# EAGLE design GasSensorCentral_v3.2 (EAGLE 7.4.0)
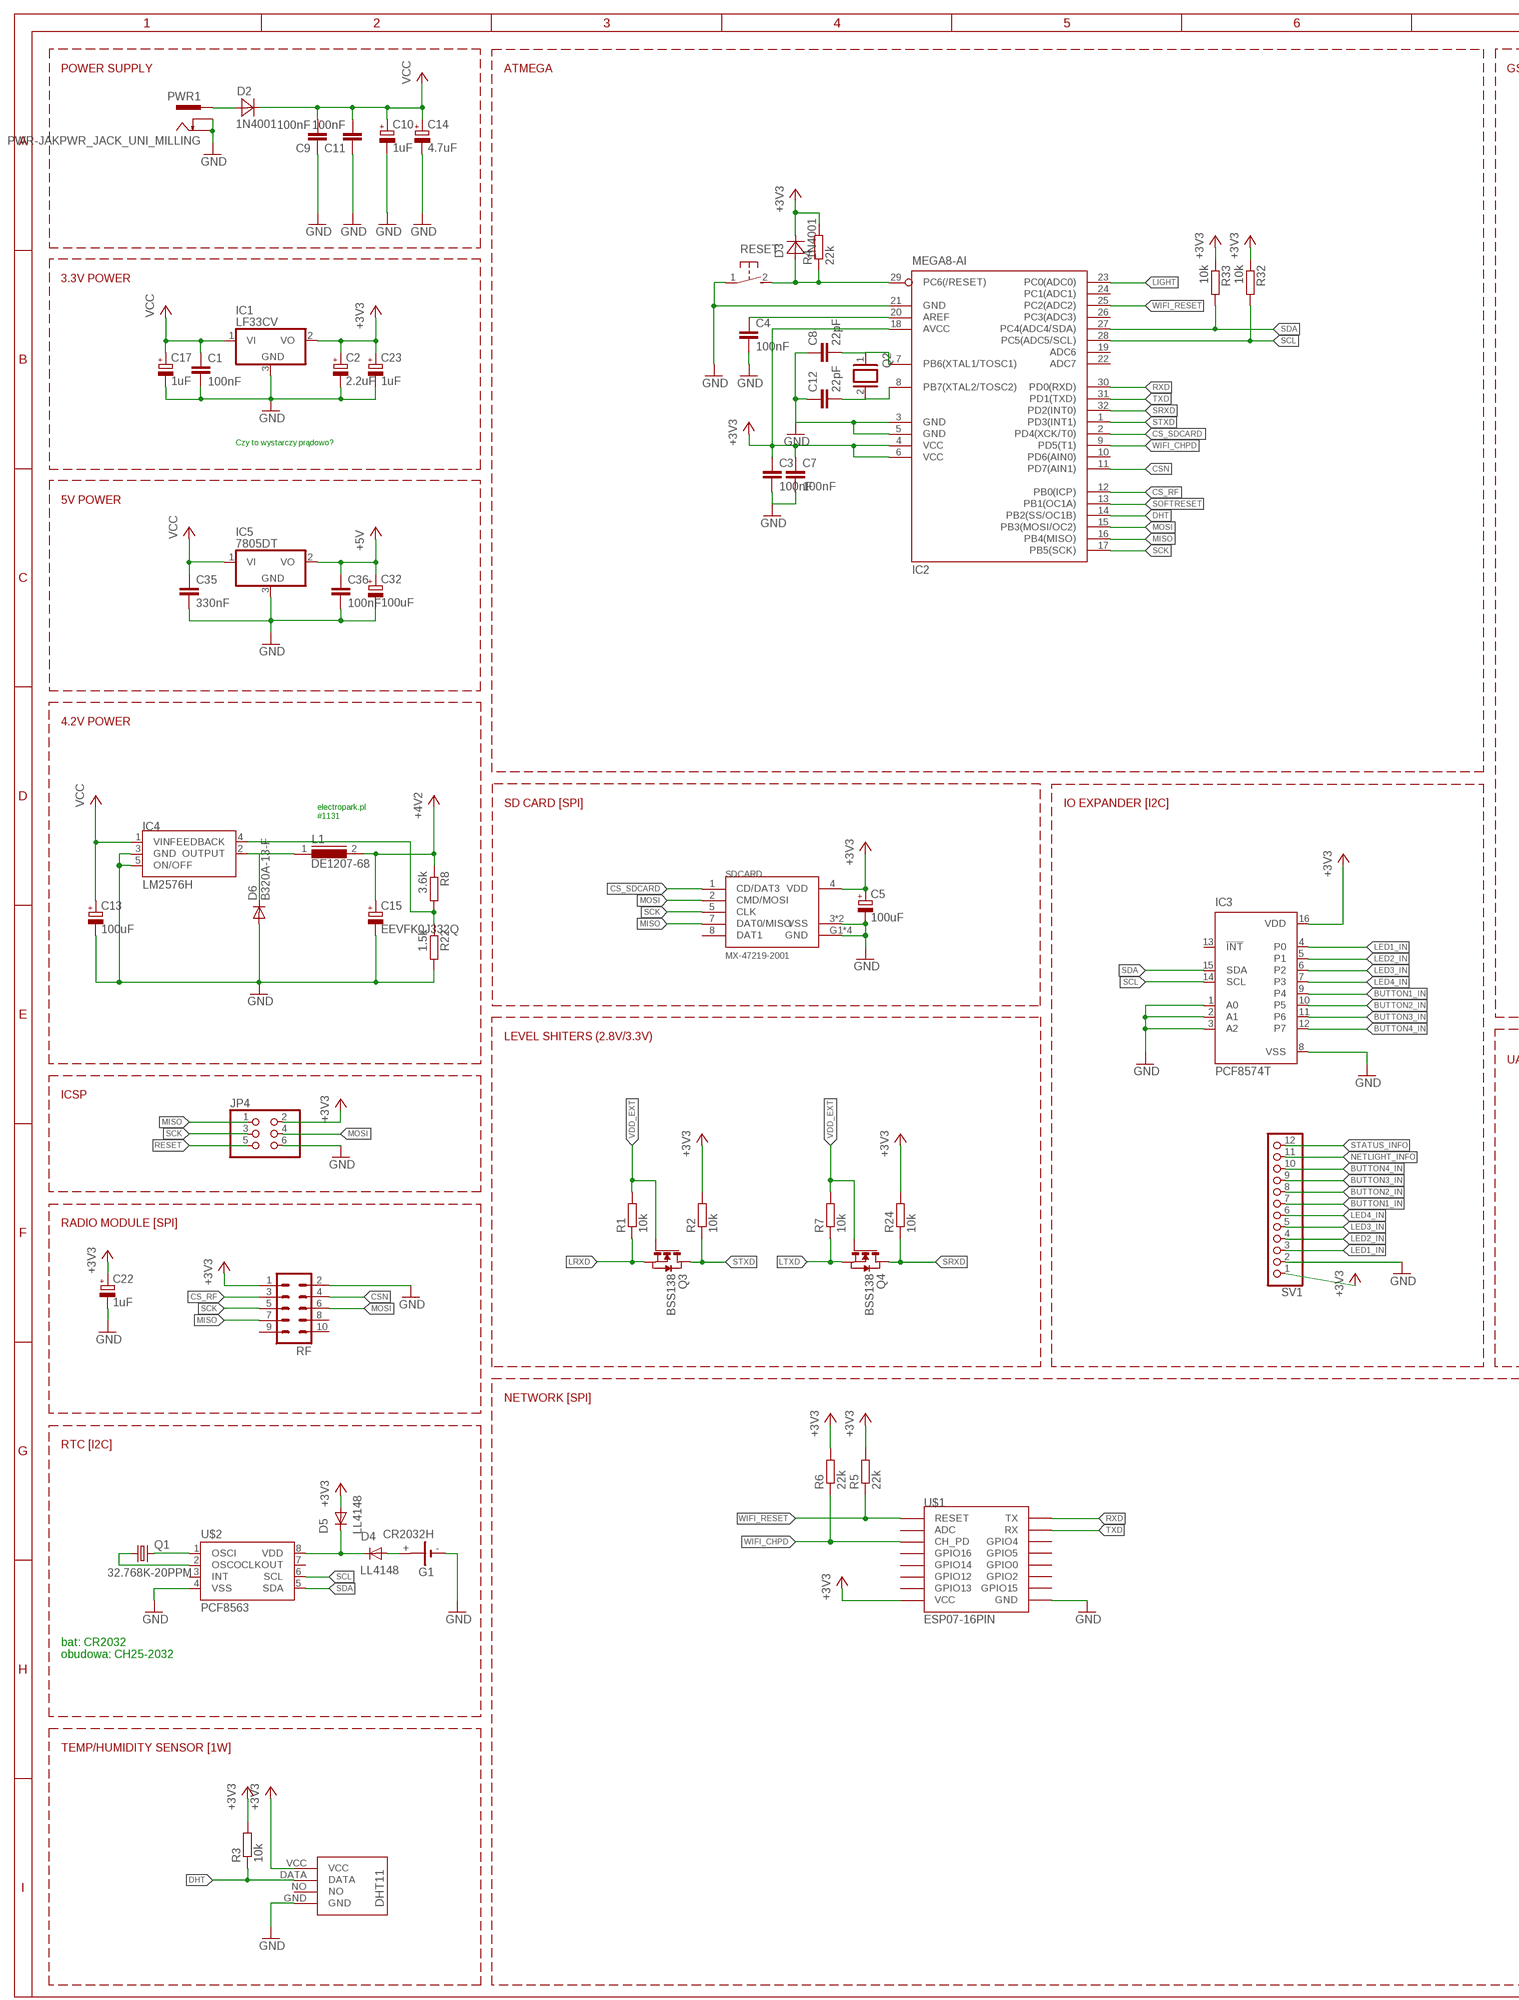
[diagram p0: schematic, sheet 1, part 1 of 2]
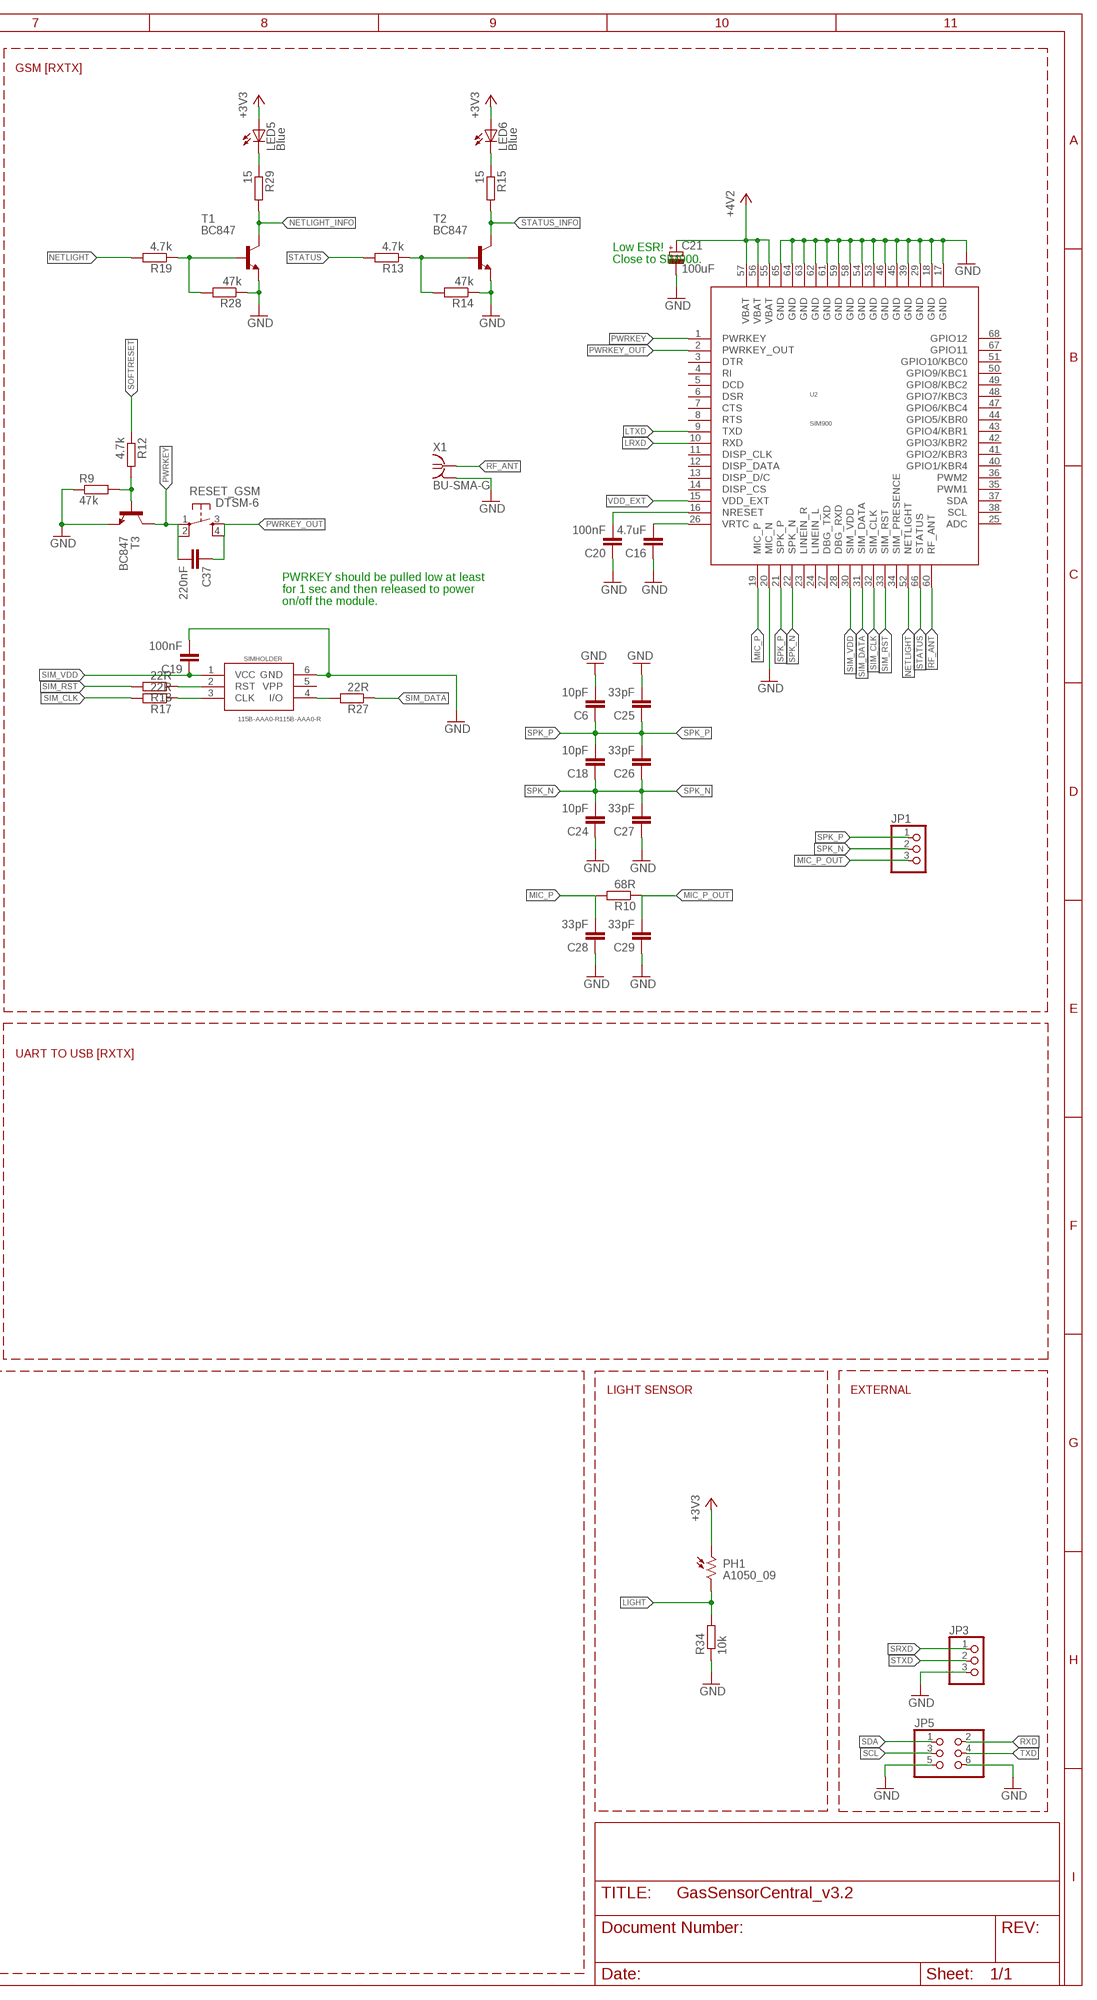
[diagram p1: schematic, sheet 1, part 2 of 2]

## Parts
C1  100nF  C-EUC0805  [C0805]
C2  2.2uF  CPOL-EUB  [PANASONIC_B]
C3  100nF  C-EUC0805  [C0805]
C4  100nF  C-EUC0805  [C0805]
C5  100uF  CPOL-EUB  [PANASONIC_B]
C6  10pF  C-EUC0805  [C0805]
C7  100nF  C-EUC0805  [C0805]
C8  22pF  C-EUC0805  [C0805]
C9  100nF  C-EUC0805  [C0805]
C10  1uF  CPOL-EUB  [PANASONIC_B]
C11  100nF  C-EUC0805  [C0805]
C12  22pF  C-EUC0805  [C0805]
C13  100uF  CPOL-EUB  [PANASONIC_B]
C14  4.7uF  CPOL-EUB  [PANASONIC_B]
C15  EEVFK0J332Q  CPOL-EU  [153CLV-1212]
C16  4.7uF  C-EUC0805  [C0805]
C17  1uF  CPOL-EUB  [PANASONIC_B]
C18  10pF  C-EUC0805  [C0805]
C19  100nF  C-EUC0805  [C0805]
C20  100nF  C-EUC0805  [C0805]
C21  100uF  CPOL-EUB  [PANASONIC_B]
C22  1uF  CPOL-EUB  [PANASONIC_B]
C23  1uF  CPOL-EUB  [PANASONIC_B]
C24  10pF  C-EUC0805  [C0805]
C25  33pF  C-EUC0805  [C0805]
C26  33pF  C-EUC0805  [C0805]
C27  33pF  C-EUC0805  [C0805]
C28  33pF  C-EUC0805  [C0805]
C29  33pF  C-EUC0805  [C0805]
C32  100uF  CPOL-EUB  [PANASONIC_B]
C35  330nF  C-EUC0805  [C0805]
C36  100nF  C-EUC0805  [C0805]
C37  220nF  C-EUC0805  [C0805]
D2  1N4001  MBRA340T3  [SMA]
D3  1N4001  MBRA340T3  [SMA]
D4  LL4148  DIODE-SOD80C  [SOD80C]
D5  LL4148  DIODE-SOD80C  [SOD80C]
D6  B320A-13-F  DIODE-DO214AC  [DO214AC]
G1  CR2032H  [CR2032H]
IC1  LF33CV  78DT  [TO252]
IC2  MEGA8-AI  [TQFP32-08]
IC3  PCF8574T  [SO16W]
IC4  LM2576H  [TO220-52]
IC5  7805DT  [TO252]
JP1  PINHD-1X3/90  [1X03/90]
JP3  PINHD-1X3  [1X03]
JP4  PINHD-2X3  [2X03]
JP5  PINHD-2X3  [2X03]
L1  DE1207-68  DE1207  [DE1207]
LED5  Blue  LEDSML0805  [SML0805]
LED6  Blue  LEDSML0805  [SML0805]
PH1  A1050_09  [T0-46-A10XX]
PWR1  PWR-JAKPWR_JACK_UNI_MILLING  [PWR_JACK_UNI_MILLING]
Q1  32.768K-20PPM  CRYSTALTC26V  [TC26V]
Q2  XTAL/S  [QS]
Q3  BSS138  NMOSSOT23  [SOT-23]
Q4  BSS138  NMOSSOT23  [SOT-23]
R1  10k  R-EU_R0805  [R0805]
R2  10k  R-EU_R0805  [R0805]
R3  10k  R-EU_R0805  [R0805]
R4  22k  R-EU_R0805  [R0805]
R5  22k  R-EU_R0805  [R0805]
R6  22k  R-EU_R0805  [R0805]
R7  10k  R-EU_R0805  [R0805]
R8  3.6k  R-EU_R0805  [R0805]
R9  47k  R-EU_R0805  [R0805]
R10  68R  R-EU_R0805  [R0805]
R12  4.7k  R-EU_R0805  [R0805]
R13  4.7k  R-EU_R0805  [R0805]
R14  47k  R-EU_R0805  [R0805]
R15  15  R-EU_R0805  [R0805]
R17  22R  R-EU_R0805  [R0805]
R18  22R  R-EU_R0805  [R0805]
R19  4.7k  R-EU_R0805  [R0805]
R22  1.5k  R-EU_R0805  [R0805]
R24  10k  R-EU_R0805  [R0805]
R27  22R  R-EU_R0805  [R0805]
R28  47k  R-EU_R0805  [R0805]
R29  15  R-EU_R0805  [R0805]
R32  10k  R-EU_R0805  [R0805]
R33  10k  R-EU_R0805  [R0805]
R34  10k  R-EU_R0805  [R0805]
RESET  31-XX  [B3F-31XX]
RESET_GSM  DTSM-6  [DTSM-6]
RF  ML10  [ML10]
SDCARD  MX-47219-2001  [MX-47219-2001]
SIMHOLDER  115B-AAA0-R115B-AAA0-R  [115B-AAA0-R]
SV1  PINHD-1X12  [1X12]
T1  BC847  [SOT23]
T2  BC847  [SOT23]
T3  BC847  [SOT23]
U2  SIM900  [SIM900]
U$1  ESP07-16PIN  [ESP07-16PIN]
U$2  PCF8563  [SO08]
U$3  DHT11-PION.  [DHT11-PION.]
X1  BU-SMA-G  [BU-SMA-G]

## Nets
+3V3: C2.+ C3.1 C5.+ C7.1 C22.+ C23.+ D3.C D5.A IC1.2(VO) IC2.4(VCC) IC2.6(VCC) IC2.18(AVCC) IC3.16(VDD) JP4.2 LED5.A LED6.A PH1.1 R2.2 R3.2 R4.2 R5.2 R6.2 R24.2 R32.1 R33.1 RF.1 SDCARD.4(VDD) SV1.1 U$1.VCC U$3.VCC
+4V2: C15.+ C21.+ L1.2 R8.1 U2.55(VBAT) U2.56(VBAT) U2.57(VBAT)
+5V: C32.+ C36.1 IC5.2(VO)
BUTTON1_IN: IC3.9(P4) SV1.7
BUTTON2_IN: IC3.10(P5) SV1.8
BUTTON3_IN: IC3.11(P6) SV1.9
BUTTON4_IN: IC3.12(P7) SV1.10
CS_RF: IC2.12(PB0(ICP)) RF.3
CS_SDCARD: IC2.2(PD4(XCK/T0)) SDCARD.1(CD/DAT3)
CSN: IC2.11(PD7(AIN1)) RF.4
DHT: IC2.14(PB2(SS/OC1B)) R3.1 U$3.DATA
GND: C1.2 C2.- C3.2 C4.2 C5.- C6.2 C7.2 C8.1 C9.1 C10.- C11.1 C12.1 C13.- C14.- C15.- C16.1 C17.- C19.2 C20.1 C21.- C22.- C23.- C24.1 C25.2 C27.1 C28.1 C29.1 C32.- C35.2 C36.2 G1.- IC1.3(GND) IC2.3(GND) IC2.5(GND) IC2.21(GND) IC3.1(A0) IC3.2(A1) IC3.3(A2) IC3.8(VSS) IC4.3(GND) IC4.5(ON/OFF) IC5.3(GND) JP3.3 JP4.6 JP5.5 JP5.6 PWR1.- PWR1.-1(-) PWR1.-2(-) PWR1.-3(-) PWR1.-4(-) PWR1.-5(-) PWR1.-6(-) PWR1.-- PWR1.--1(--) PWR1.--2(--) PWR1.--3(--) PWR1.--4(--) PWR1.--5(--) PWR1.--6(--) R9.1 R14.1 R22.2 R28.1 R34.1 RESET.1(P) RF.2 SDCARD.3(VSS) SDCARD.6(VSS) SDCARD.G1(GND) SDCARD.G2(GND) SDCARD.G3(GND) SDCARD.G4(GND) SIMHOLDER.6(GND) SV1.2 T1.2(E) T2.2(E) T3.2(E) U2.17(GND) U2.18(GND) U2.20(MIC_N) U2.29(GND) U2.39(GND) U2.45(GND) U2.46(GND) U2.53(GND) U2.54(GND) U2.58(GND) U2.59(GND) U2.61(GND) U2.62(GND) U2.63(GND) U2.64(GND) U2.65(GND) U$1.GND U$2.4(VSS) U$3.GND X1.2 X1.3 X1.4 X1.5
LED1_IN: IC3.4(P0) SV1.3
LED2_IN: IC3.5(P1) SV1.4
LED3_IN: IC3.6(P2) SV1.5
LED4_IN: IC3.7(P3) SV1.6
LIGHT: IC2.23(PC0(ADC0)) PH1.2 R34.2
LRXD: Q3.2(S) R1.1 U2.10(RXD)
LTXD: Q4.2(S) R7.1 U2.9(TXD)
MIC_P: C28.2 R10.2 U2.19(MIC_P)
MIC_P_OUT: C29.2 JP1.3 R10.1
MISO: IC2.16(PB4(MISO)) JP4.1 RF.7 SDCARD.7(DAT0/MISO)
MOSI: IC2.15(PB3(MOSI/OC2)) JP4.4 RF.6 SDCARD.2(CMD/MOSI)
N$1: C4.1 IC2.20(AREF)
N$2: Q1.1 U$2.2(OSCO)
N$3: IC4.4(FEEDBACK) R8.2 R22.1
N$4: D2.A PWR1.+ PWR1.+1(+) PWR1.+2(+) PWR1.+3(+) PWR1.+4(+) PWR1.+5(+) PWR1.+6(+)
N$5: D4.C D5.C U$2.8(VDD)
N$6: R27.2 SIMHOLDER.4(I/O)
N$7: LED5.C R29.1
N$8: Q1.2 U$2.1(OSCI)
N$9: R13.1 R14.2 T2.1(B)
N$10: D6.A
N$11: LED6.C R15.1
N$12: D6.C IC4.2(OUTPUT) L1.1
N$13: C20.2 U2.16(NRESET)
N$14: R9.2 R12.2 T3.1(B)
N$15: R19.1 R28.2 T1.1(B)
N$16: D4.A G1.+
N$17: C16.2 U2.26(VRTC)
N$24: R18.1 SIMHOLDER.2(RST)
N$25: R17.1 SIMHOLDER.3(CLK)
N$29: C8.2 IC2.7(PB6(XTAL1/TOSC1)) Q2.1
N$35: C12.2 IC2.8(PB7(XTAL2/TOSC2)) Q2.2
NETLIGHT: R19.2 U2.52(NETLIGHT)
NETLIGHT_INFO: R29.2 SV1.11 T1.3(C)
PWRKEY: C37.2 RESET_GSM.1 RESET_GSM.2 T3.3(C) U2.1(PWRKEY)
PWRKEY_OUT: C37.1 RESET_GSM.3 RESET_GSM.4 U2.2(PWRKEY_OUT)
RESET: D3.A IC2.29(PC6(/RESET)) JP4.5 R4.1 RESET.2(S)
RF_ANT: U2.60(RF_ANT) X1.1
RXD: IC2.30(PD0(RXD)) JP5.2 U$1.TX
SCK: IC2.17(PB5(SCK)) JP4.3 RF.5 SDCARD.5(CLK)
SCL: IC2.28(PC5(ADC5/SCL)) IC3.14(SCL) JP5.3 R32.2 U$2.6(SCL)
SDA: IC2.27(PC4(ADC4/SDA)) IC3.15(SDA) JP5.1 R33.2 U$2.5(SDA)
SIM_CLK: R17.2 U2.32(SIM_CLK)
SIM_DATA: R27.1 U2.31(SIM_DATA)
SIM_RST: R18.2 U2.33(SIM_RST)
SIM_VDD: C19.1 SIMHOLDER.1(VCC) U2.30(SIM_VDD)
SOFTRESET: IC2.13(PB1(OC1A)) R12.1
SPK_N: C18.1 C24.2 C26.1 C27.2 JP1.2 U2.22(SPK_N)
SPK_P: C6.1 C18.2 C25.1 C26.2 JP1.1 U2.21(SPK_P)
SRXD: IC2.32(PD2(INT0)) JP3.1 Q4.1(D) R24.1
STATUS: R13.2 U2.66(STATUS)
STATUS_INFO: R15.2 SV1.12 T2.3(C)
STXD: IC2.1(PD3(INT1)) JP3.2 Q3.1(D) R2.1
TXD: IC2.31(PD1(TXD)) JP5.4 U$1.RX
VCC: C1.1 C9.2 C10.+ C11.2 C13.+ C14.+ C17.+ C35.1 D2.C IC1.1(VI) IC4.1(VIN) IC5.1(VI)
VDD_EXT: Q3.3(G) Q4.3(G) R1.2 R7.2 U2.15(VDD_EXT)
WIFI_CHPD: IC2.9(PD5(T1)) R6.1 U$1.CH_PD
WIFI_RESET: IC2.25(PC2(ADC2)) R5.1 U$1.REST(RESET)
Unconnected: IC2.10(PD6(AIN0)) IC2.19(ADC6) IC2.22(ADC7) IC2.24(PC1(ADC1)) IC2.26(PC3(ADC3)) IC3.13(!INT) RF.8 RF.9 RF.10 SDCARD.8(DAT1) SIMHOLDER.5(VPP) U2.3(DTR) U2.4(RI) U2.5(DCD) U2.6(DSR) U2.7(CTS) U2.8(RTS) U2.11(DISP_CLK) U2.12(DISP_DATA) U2.13(DISP_D/C) U2.14(DISP_CS) U2.23(LINEIN_R) U2.24(LINEIN_L) U2.25(ADC) U2.27(DBG_TXD) U2.28(DBG_RXD) U2.34(SIM_PRESENCE) U2.35(PWM1) U2.36(PWM2) U2.37(SDA) U2.38(SCL) U2.40(GPIO1/KBR4) U2.41(GPIO2/KBR3) U2.42(GPIO3/KBR2) U2.43(GPIO4/KBR1) U2.44(GPIO5/KBR0) U2.47(GPIO6/KBC4) U2.48(GPIO7/KBC3) U2.49(GPIO8/KBC2) U2.50(GPIO9/KBC1) U2.51(GPIO10/KBC0) U2.67(GPIO11) U2.68(GPIO12) U$1.ADC U$1.GPIO0 U$1.GPIO2 U$1.GPIO4 U$1.GPIO5 U$1.GPIO12 U$1.GPIO13 U$1.GPIO14 U$1.GPIO15 U$1.GPIO16 U$2.3(INT) U$2.7(CLKOUT) U$3.NO

## Notes on the sheet
- POWER SUPPLY | ATMEGA | GSM [RXTX]
- Low ESR!
  Close to SIM900.
- 3.3V POWER
- Czy to wystarczy prądowo?
- 5V POWER
- PWRKEY should be pulled low at least 
  for 1 sec and then released to power 
  on/off the module.
- 4.2V POWER
- SD CARD [SPI] | IO EXPANDER [I2C]
- electropark.pl
  #1131
- LEVEL SHITERS (2.8V/3.3V)
- UART TO USB [RXTX]
- ICSP
- RADIO MODULE [SPI]
- NETWORK [SPI] | LIGHT SENSOR | EXTERNAL
- RTC [I2C]
- bat: CR2032
  obudowa: CH25-2032
- TEMP/HUMIDITY SENSOR [1W]

## Library data of the parts
C1 C3 C4 C6-C9 C11 C12 C16 C18-C20 C24-C29 C35-C37 = rcl:C-EU: CAPACITOR, European symbol
C2 C5 C10 C13 C14 C17 C21-C23 C32 = rcl:CPOL-EU: POLARIZED CAPACITOR, European symbol
C15 = hosho:CPOL-EU: POLARIZED CAPACITOR, European symbol
D2 D3 = diode:MBRA340T3: Surface Mount Schottky Power Rectifier Source: http://www.onsemi.com/pub_link/Collateral/MBRA340T3-D.PDF
D4-D6 = diode:DIODE-: DIODE
G1 = hosho:CR2032H: LI BATTERY Varta
IC1 = hosho:78*: Positive VOLTAGE REGULATOR Source: http://cache.national.com/ds/LM/LM78L05.pdf http://www.fairchildsemi.com/ds/LM/LM7805.pdf
IC2 = atmel:MEGA8: MICROCONTROLLER 8 Kbytes FLASH, 1 kbytes SRAM, 512 bytes EEPROM, USART, 6-channel 10 bit ADC, 2-channel 8 bit ADC Pin compatible with Atmega48, ATMega88, ATMega168 Source: avr.lbr; MPN: ATMEGA8-16AU; OC_FARNELL: 9171371; OC_NEWARK: 73M8863
IC3 = micro-philips:PCF8574: I2C-Bus Remote 8-bit I/O expander http://www.semiconductors.philips.com/acrobat_download/datasheets/PCF8574_4.pdf; MPN: PCF8574T/3,512; OC_FARNELL: 1201255; OC_NEWARK: 70R6870
IC4 = hosho:LM2576H
IC5 = linear:78*: Positive VOLTAGE REGULATOR Source: http://cache.national.com/ds/LM/LM78L05.pdf http://www.fairchildsemi.com/ds/LM/LM7805.pdf
JP1 JP3 = pinhead:PINHD-1X3: PIN HEADER
JP4 JP5 = pinhead:PINHD-2X3: PIN HEADER
L1 = hosho:DE1207: High Power Density, High Efficiency, Shielded Inductors Source: coiltronics_dr_series.pdf
LED5 LED6 = led:LED: LED OSRAM: - CHIPLED LG R971, LG N971, LY N971, LG Q971, LY Q971, LO R971, LY R971 LH N974, LH R974 LS Q976, LO Q976, LY Q976 LO Q996 - Hyper CHIPLED LW Q18S LB Q993, LB Q99A, LB R99A - SideLED LS A670, LO A670, LY A670, LG A670, LP A670 LB A673, LV A673, LT A673, LW A673 LH A674 LY A675 LS A676, LA A676, LO A676, LY A676, LW A676 LS A679, LY A679, LG A679 - Hyper Micro SIDELED® LS Y876, LA Y876, LO Y876, LY Y876 LT Y87S - SmartLED LW L88C, LW L88S LB L89C, LB L89S, LG L890 LS L89K, LO L89K, LY L89K LS L896, LA L896, LO L896, LY L896 - TOPLED LS T670, LO T670, LY T670, LG T670, LP T670 LSG T670, LSP T670, LSY T670, LOP T670, LYG T670 LG T671, LOG T671, LSG T671 LB T673, LV T673, LT T673, LW T673 LH T674 LS T676, LA T676, LO T676, LY T676, LB T676, LH T676, LSB T676, LW T676 LB T67C, LV T67C, LT T67C, LS T67K, LO T67K, LY T67K, LW E67C LS E67B, LA E67B, LO E67B, LY E67B, LB E67C, LV E67C, LT E67C LW T67C LS T679, LY T679, LG T679 LS T770, LO T770, LY T770, LG T770, LP T770 LB T773, LV T773, LT T773, LW T773 LH T774 LS E675, LA E675, LY E675, LS T675 LS T776, LA T776, LO T776, LY T776, LB T776 LHGB T686 LT T68C, LB T68C - Hyper Mini TOPLED® LB M676 - Mini TOPLED Santana® LG M470 LS M47K, LO M47K, LY M47K Source: http://www.osram.convergy.de LUXEON: - LUMILED® LXK2-PW12-R00, LXK2-PW12-S00, LXK2-PW14-U00, LXK2-PW14-V00 LXK2-PM12-R00, LXK2-PM12-S00, LXK2-PM14-U00 LXK2-PE12-Q00, LXK2-PE12-R00, LXK2-PE12-S00, LXK2-PE14-T00, LXK2-PE14-U00 LXK2-PB12-K00, LXK2-PB12-L00, LXK2-PB12-M00, LXK2-PB14-N00, LXK2-PB14-P00, LXK2-PB14-Q00 LXK2-PR12-L00, LXK2-PR12-M00, LXK2-PR14-Q00, LXK2-PR14-R00 LXK2-PD12-Q00, LXK2-PD12-R00, LXK2-PD12-S00 LXK2-PH12-R00, LXK2-PH12-S00 LXK2-PL12-P00, LXK2-PL12-Q00, LXK2-PL12-R00 Source: www.luxeon.com KINGBRIGHT: KA-3528ASYC Source: www.kingbright.com
PH1 = photo-elements:A10: Sensor Robust Light Sensing Applications Outdoor Light Sensing Application Source: http://optoelectronics.perkinelmer.com/content/Datasheets/DTS_PhotocellsA1050.pdf
PWR1 = hosho:PWR-JAK
Q1 = crystal:CRYSTAL: CRYSTAL; OC_FARNELL: unknown; OC_NEWARK: unknown
Q2 = special:XTAL/S: CRYSTAL
Q3 Q4 = zetex:NMOSSOT23: MOS FET; OC_FARNELL: unknown; OC_NEWARK: unknown
R1-R10 R12-R15 R17-R19 R22 R24 R27-R29 R32-R34 = rcl:R-EU_: RESISTOR, European symbol
RESET = switch-omron:31-XX: OMRON SWITCH; MPN: B3F-3100; OC_FARNELL: 959704; OC_NEWARK: 36M3582
RESET_GSM = hosho:DTSM-6
RF = con-harting-ml:ML10: HARTING; OC_FARNELL: unknown; OC_NEWARK: unknown
SDCARD = hosho:MX-47219-2001
SIMHOLDER = hosho:115B-AAA0-R
SV1 = pinhead:PINHD-1X12: PIN HEADER
T1-T3 = transistor:BC847: NPN TRANSISTOR
U2 = ICs_v54:SIM900
U$1 = esp8266modules:ESP07-16PIN: ESP8266 Wifi module 07 - 16 pins; DIMENSIONS: 22.0 x 16.0 mm; PINS: 16; PITCH: 0.078" / 2 mm
U$2 = hosho:PCF8563
U$3 = DHT11:DHT11-PION.: DHT11 Czujnik temperatury i wilgotności (widok pionowy)
X1 = hosho:BU-SMA-G: FEMALE SMA CONNECTOR Radiall distributor RS 193-9117; OC_FARNELL: unknown; OC_NEWARK: unknown

## Board
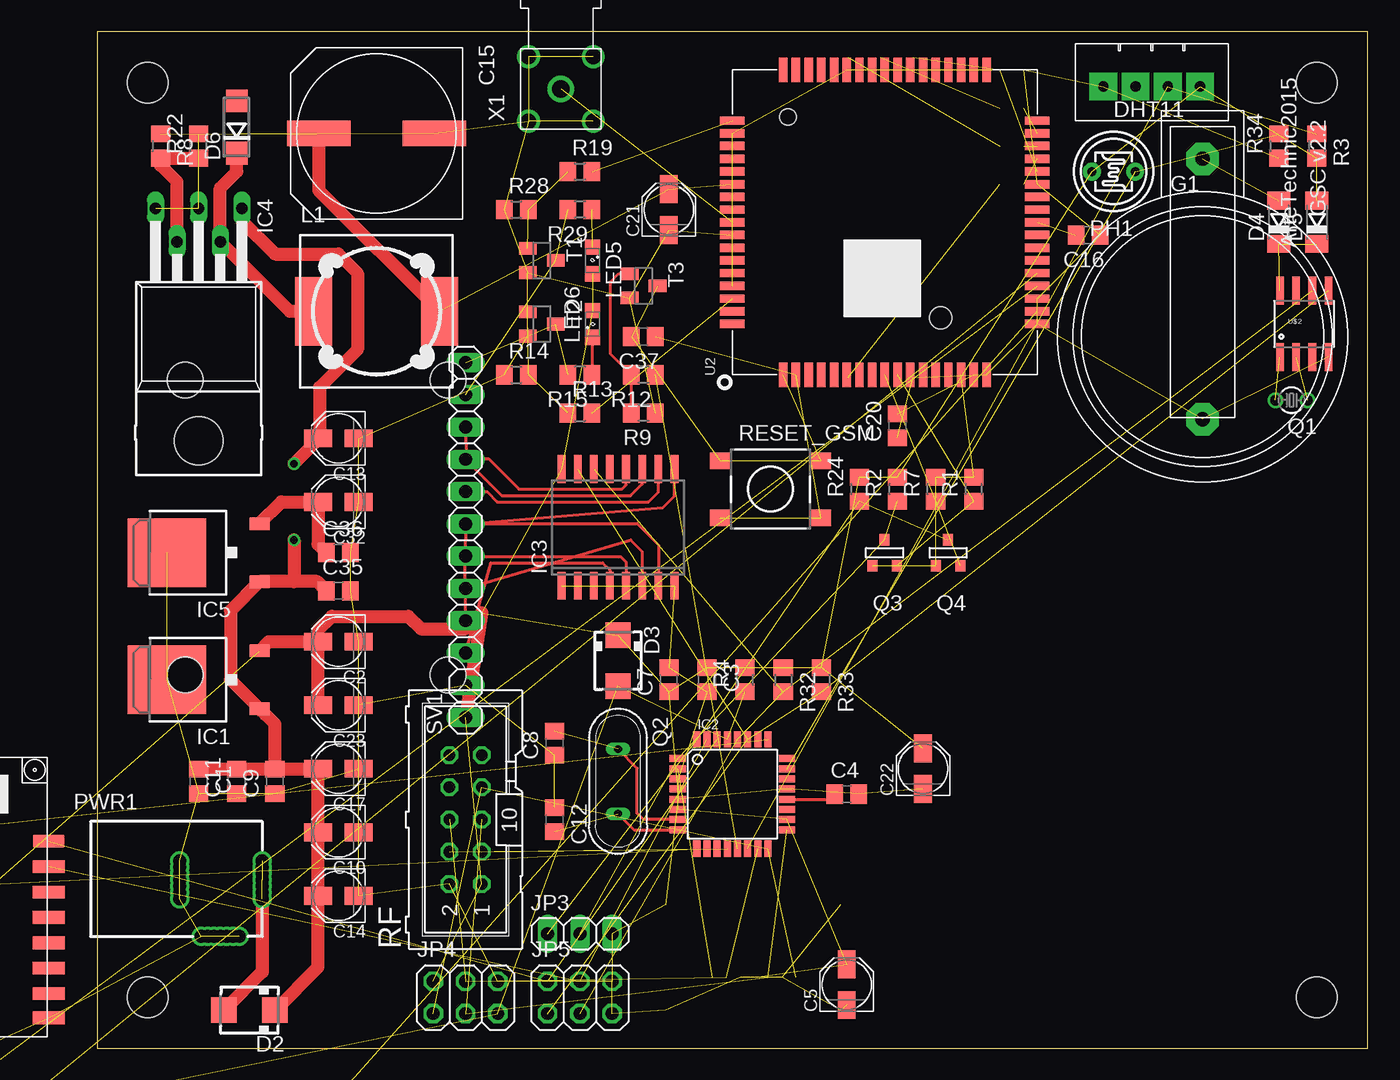
[diagram p2: board, top side]
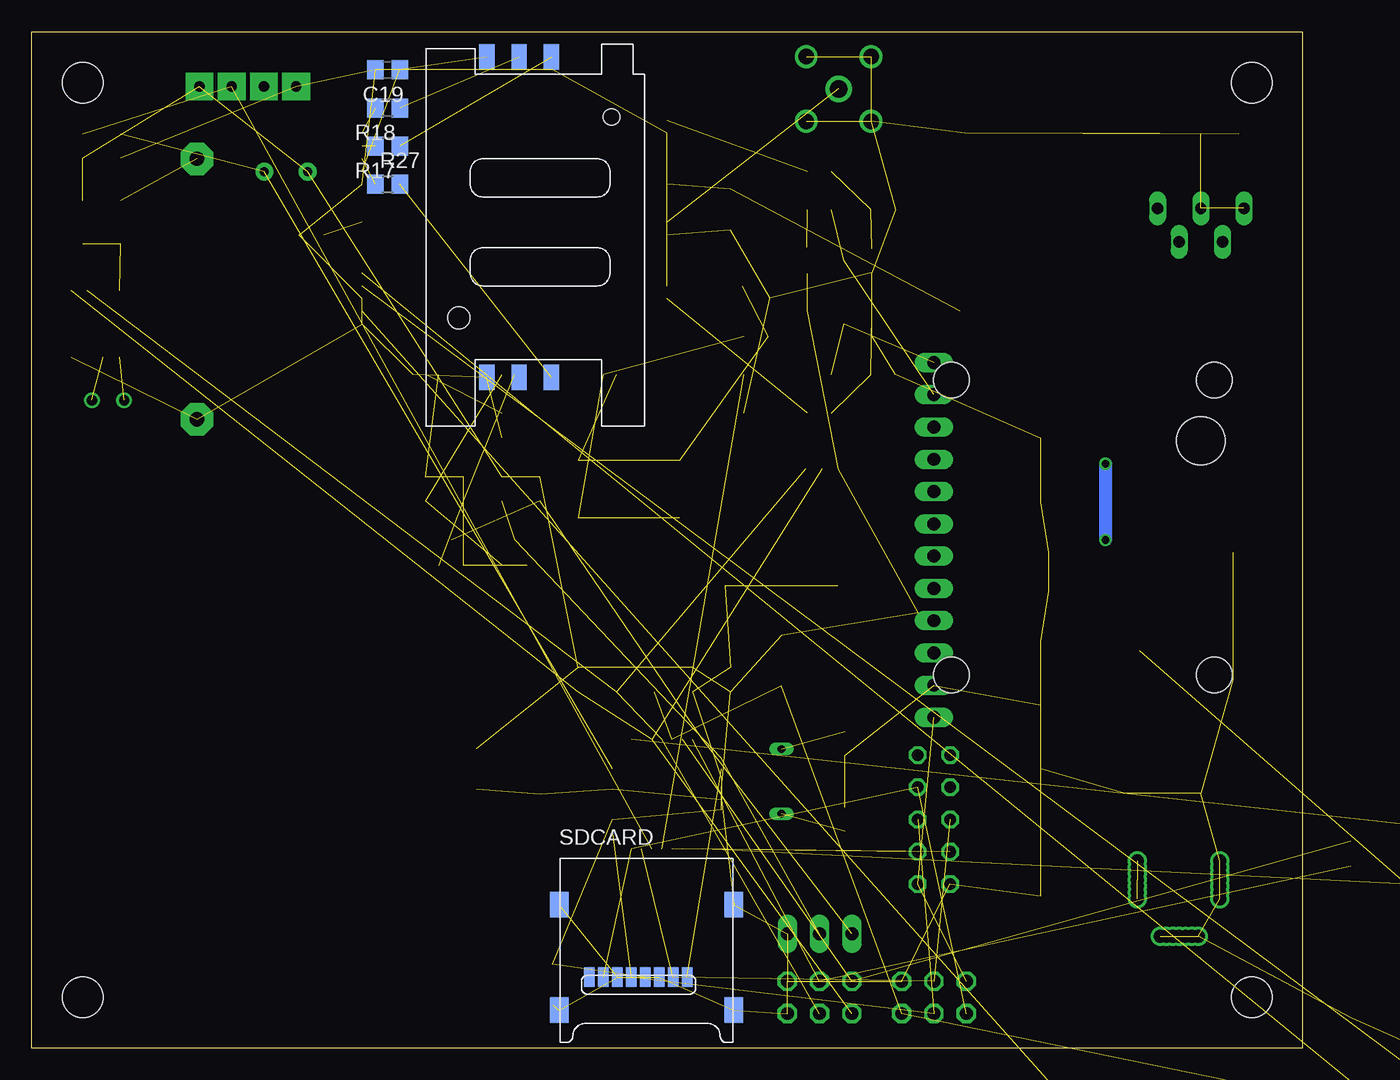
[diagram p3: board, bottom side, seen from below]

Size 100 x 80 mm. Coordinates in mm from the lower left corner, seen from the top.
Outline: 0,0 100,0 100,80 0,80 0,0
Copper layers (1*16): Top 0.0356mm / dielectric 1.5011mm / Bottom 0.0356mm
Design rules "oshpark-2layer *": minimum track width 6mil, minimum drill 13mil, track to track 6mil, track to pad 6mil, pad to pad 6mil, via to via 6mil, smd to smd 6mil, copper to edge 15mil, drill to drill 6mil, minimum pad ring 7mil, minimum via ring 7mil, stop-mask expansion 4mil, vias tented up to drill 12mil, thermal gap 10mil
Holes 3.2 mm at 4,4 96,4 96,76 4,76
Holes 2.8 mm at 27.62,52.58 27.62,29.38 6.92,52.58 6.92,29.38
tRestrict: area 58.4,57.2 to 65.2,64

### Footprints (pad centres in the part's own frame; a part is rotated, then mirrored left to right if it is on the bottom)
C0805 = smd 1.3 x 1.5: 1 -0.95,0; 2 0.95,0
PANASONIC_B = smd 2.2 x 1.4: + 1.6,0; - -1.6,0
153CLV-1212 = smd 2 x 5: + 0,-4.55; - 0,4.55
SMA = smd 2 x 2: A 2,0; C -2,0
SOD80C = smd 1.4 x 1.8: A 1.7,0; C -1.7,0
DO214AC = smd 1.8 x 1.7: A 2.05,0; C -2.05,0
CR2032H = drill 1.118 pad 2.54 octagon: + 0,14; - 0,-6.5
TO252 = smd 1 x 1.6: 1 -2.28,-4.8; 2 2.28,-4.8 | smd 5.4 x 6.2: 3 0,2.5
TQFP32-08 = smd 1.27 x 0.559: 1 -4.293,2.8; 2 -4.293,2; 3 -4.293,1.2; 4 -4.293,0.4; 5 -4.293,-0.4; 6 -4.293,-1.2; 7 -4.293,-2; 8 -4.293,-2.8; 17 4.293,-2.8; 18 4.293,-2; 19 4.293,-1.2; 20 4.293,-0.4; 21 4.293,0.4; 22 4.293,1.2; 23 4.293,2; 24 4.293,2.8 | smd 0.559 x 1.27: 9 -2.8,-4.293; 10 -2,-4.293; 11 -1.2,-4.293; 12 -0.4,-4.293; 13 0.4,-4.293; 14 1.2,-4.293; 15 2,-4.293; 16 2.8,-4.293; 25 2.8,4.293; 26 2,4.293; 27 1.2,4.293; 28 0.4,4.293; 29 -0.4,4.293; 30 -1.2,4.293; 31 -2,4.293; 32 -2.8,4.293
SO16W = smd 0.6 x 2.2: 1 -4.445,-4.6; 2 -3.175,-4.6; 3 -1.905,-4.6; 4 -0.635,-4.6; 5 0.635,-4.6; 6 1.905,-4.6; 7 3.175,-4.6; 8 4.445,-4.6; 9 4.445,4.6; 10 3.175,4.6; 11 1.905,4.6; 12 0.635,4.6; 13 -0.635,4.6; 14 -1.905,4.6; 15 -3.175,4.6; 16 -4.445,4.6
TO220-52 = drill 0.9 long: 1 -3.4,-21.1; 2 -1.7,-18.47; 3 0,-21.1; 4 1.7,-18.47; 5 3.4,-21.1 | hole 3.8: 0,-2.8
1X03/90 = drill 1.016 long: 1 -2.54,-3.81; 2 0,-3.81; 3 2.54,-3.81
1X03 = drill 1.016 long: 1 -2.54,0; 2 0,0; 3 2.54,0
2X03 = drill 1.016 octagon: 1 -2.54,-1.27; 2 -2.54,1.27; 3 0,-1.27; 4 0,1.27; 5 2.54,-1.27; 6 2.54,1.27
DE1207 = smd 2.9 x 5.4: 1 -4.95,0; 2 4.95,0
SML0805 = smd 1.2 x 1.2: A 1.05,0; C -1.05,0
T0-46-A10XX = drill 0.7 pad 1.4: 1 -1.7,0; 2 1.7,0
PWR_JACK_UNI_MILLING = drill 1: + 0,4.75; +1 0,5.25; +2 0,5.75; +3 0,6.25; +4 0,4.25; +5 0,3.75; +6 0,3.25; - -6.5,4.75; -1 -6.5,5.25; -2 -6.5,5.75; -3 -6.5,4.25; -4 -6.5,3.75; -5 -6.5,6.25; -6 -6.5,3.25; -- -3.3,0.3; --1 -3.8,0.3; --2 -4.3,0.3; --3 -4.8,0.3; --4 -2.8,0.3; --5 -2.3,0.3; --6 -1.8,0.3
TC26V = drill 0.813: 1 -1.27,0; 2 1.27,0
QS = drill 0.61 long: 1 -2.54,0; 2 2.54,0
SOT-23 = smd 0.787 x 0.889: 1 0.025,-1.016; 2 -0.94,1.016; 3 0.991,1.016
R0805 = smd 1.3 x 1.5: 1 -0.95,0; 2 0.95,0
B3F-31XX = drill 1.016 octagon: 1 -2.261,-1.245; 2 2.261,-1.245 | drill 1.499 pad 2.159: 3 -3.505,1.245; 4 3.505,1.245
DTSM-6 = smd 1.55 x 1.3: 1 -3.975,2.25; 2 3.975,2.25; 3 -3.975,-2.25; 4 3.975,-2.25
ML10 = drill 0.914 octagon: 1 -5.08,-1.27; 2 -5.08,1.27; 3 -2.54,-1.27; 4 -2.54,1.27; 5 0,-1.27; 6 0,1.27; 7 2.54,-1.27; 8 2.54,1.27; 9 5.08,-1.27; 10 5.08,1.27
MX-47219-2001 = smd 0.8 x 1.5: 1 10.08,2.6; 2 8.98,2.6; 3 7.88,2.6; 4 6.78,2.6; 5 5.68,2.6; 6 4.58,2.6; 7 3.48,2.6; 8 2.38,2.6 | smd 1.45 x 2: G1 13.75,0; G2 13.75,8.3; G3 0,8.3; G4 0,0
115B-AAA0-R = smd 2 x 1.2: 1 -13,-3.19; 2 -13,-0.65; 3 -13,1.89; 4 12.2,1.89; 5 12.2,-0.65; 6 12.2,-3.19 | hole 1.75: 7.5,-5.38 | hole 1.3: -8.3,6.62
1X12 = drill 1.016 long: 1 -13.97,0; 2 -11.43,0; 3 -8.89,0; 4 -6.35,0; 5 -3.81,0; 6 -1.27,0; 7 1.27,0; 8 3.81,0; 9 6.35,0; 10 8.89,0; 11 11.43,0; 12 13.97,0
SOT23 = smd 1 x 1.4: 1 -0.95,-1.1; 2 0.95,-1.1; 3 0,1.1
SIM900 = smd 1.93 x 0.66: 1 -12,8; 2 -12,7; 3 -12,6; 4 -12,5; 5 -12,4; 6 -12,3; 7 -12,2; 8 -12,1; 9 -12,0; 10 -12,-1; 11 -12,-2; 12 -12,-3; 13 -12,-4; 14 -12,-5; 15 -12,-6; 16 -12,-7; 17 -12,-8; 35 12,-8; 36 12,-7; 37 12,-6; 38 12,-5; 39 12,-4; 40 12,-3; 41 12,-2; 42 12,-1; 43 12,0; 44 12,1; 45 12,2; 46 12,3; 47 12,4; 48 12,5; 49 12,6; 50 12,7; 51 12,8 | smd 0.66 x 1.93: 18 -8,-12; 19 -7,-12; 20 -6,-12; 21 -5,-12; 22 -4,-12; 23 -3,-12; 24 -2,-12; 25 -1,-12; 26 0,-12; 27 1,-12; 28 2,-12; 29 3,-12; 30 4,-12; 31 5,-12; 32 6,-12; 33 7,-12; 34 8,-12; 52 8,12; 53 7,12; 54 6,12; 55 5,12; 56 4,12; 57 3,12; 58 2,12; 59 1,12; 60 0,12; 61 -1,12; 62 -2,12; 63 -3,12; 64 -4,12; 65 -5,12; 66 -6,12; 67 -7,12; 68 -8,12
ESP07-16PIN = smd 2.5 x 1: ADC -8.2,3.8; CH_PD -8.2,1.8; GND 8.2,-8.105; GPIO0 8.2,-2.2; GPIO2 8.2,-4.2; GPIO4 8.2,1.8; GPIO5 8.2,-0.2; GPIO12 -8.2,-4.2; GPIO13 -8.2,-6.2; GPIO14 -8.2,-2.2; GPIO15 8.2,-6.2; GPIO16 -8.2,-0.2; REST -8.2,5.8; RX 8.2,3.8; TX 8.2,5.8; VCC -8.2,-8.105
SO08 = smd 0.61 x 2.21: 1 -1.905,-2.616; 2 -0.635,-2.616; 3 0.635,-2.616; 4 1.905,-2.616; 5 1.905,2.616; 6 0.635,2.616; 7 -0.635,2.616; 8 -1.905,2.616
DHT11-PION. = drill 0.8 pad 2.184 square: DATA -1.27,0.305; GND 3.81,0.305; NO 1.27,0.305; VCC -3.81,0.305
BU-SMA-G = drill 1.4: 1 0,0 | drill 1.2: 2 -2.55,2.55; 3 2.55,2.55; 4 2.55,-2.55; 5 -2.55,-2.55

### Placement (x,y rotation side)
C1  8,21 270 top
C2  19,32 180 top
C3  48,29 270 top
C4  59,20 0 top
C5  59,5 90 top
C6  -29,-17.5 0 top  (outside the outline)
C7  45,29 90 top
C8  36,24 90 top
C9  14,21 90 top
C10  19,17 180 top
C11  11,21 90 top
C12  36,18 270 top
C13  19,48 180 top
C14  19,12 180 top
C15  22,72 270 top
C16  78,64 180 top
C17  19,22 180 top
C18  -29,-24 0 top  (outside the outline)
C19  72,77 180 bottom
C20  63,49 90 top
C21  45,66 90 top
C22  65,22 90 top
C23  19,27 180 top
C24  -29,-30.5 0 top  (outside the outline)
C25  -29,-37 0 top  (outside the outline)
C26  -29,-43.5 0 top  (outside the outline)
C27  -29,-50 0 top  (outside the outline)
C28  -29,-56.5 0 top  (outside the outline)
C29  -29,-63 0 top  (outside the outline)
C32  19,43 180 top
C35  19,36 0 top
C36  19,39 0 top
C37  43,56 180 top
D2  12,3 180 top
D3  41,30.5 270 top
D4  93,65 90 top
D5  96,65 90 top
D6  11,72.5 90 top
G1  87,56 0 top
IC1  8,29 90 top
IC2  50,20 0 top
IC3  41,41 0 top
IC4  8,45 180 top
IC5  8,39 90 top
JP1  -37.5,-66.5 0 top  (outside the outline)
JP3  38,9 0 top
JP4  29,4 0 top
JP5  38,4 0 top
L1  22,58 0 top
LED5  39,62 270 top
LED6  39,57 90 top
PH1  80,69 0 top
PWR1  13,8.5 0 top
Q1  94,51 180 top
Q2  41,21 270 top
Q3  62,39 180 top
Q4  67,39 180 top
R1  69,44 90 top
R2  63,44 90 top
R3  96,71 270 top
R4  51,29 90 top
R5  -19.5,-4.5 0 top  (outside the outline)
R6  -19.5,-11 0 top  (outside the outline)
R7  66,44 90 top
R8  5,71 270 top
R9  43,50 180 top
R10  -29,-69.5 0 top  (outside the outline)
R12  43,53 180 top
R13  38,50 0 top
R14  33,53 0 top
R15  38,53 180 top
R17  72,71 180 bottom
R18  72,74 180 bottom
R19  38,69 0 top
R22  8,71 90 top
R24  60,44 90 top
R27  72,68 0 bottom
R28  33,66 0 top
R29  38,66 180 top
R32  54,29 270 top
R33  57,29 270 top
R34  93,71 90 top
RESET  -26.5,-7.5 0 top  (outside the outline)
RESET_GSM  53,44 0 top
RF  29,18 90 top
SDCARD  58.5,3 0 bottom
SIMHOLDER  61,65 270 bottom
SV1  29,40 90 top
T1  35,62 270 top
T2  35,57 270 top
T3  43,60 270 top
U2  62,65 90 top
U$1  -12,10.5 0 top  (outside the outline)
U$2  95,57 0 top
U$3  83,76 180 top
X1  36.5,75.5 90 top

### Tracks (layer width: path | path; a pad name or v marks a point on that pad's centre or on a via)
+3V3  (26 unrouted)
  Top 1.016: C23.+ C2.+ | IC1.2 13.52,32 C2.+ | C2.+ 17.4,32.9 18.5,34 24.5,34 25.5,33 29,33 30.27,34.27 SV1.1
+4V2  (5 unrouted)
  Top 1.016: C15.+ 17.45,67.5 L1.2
+5V
  Top 1.016: IC5.2 14.52,43 C32.+ 17.4,39.65 C36.1
BUTTON1_IN
  Top 0.254: SV1.7 44.54,42.54 45.45,43.45 IC3.9
BUTTON2_IN
  Top 0.254: SV1.8 30.7,43.8 31.5,43 43.4,43 44.17,43.77 IC3.10
BUTTON3_IN
  Top 0.254: SV1.9 31.85,43.5 42,43.5 42.91,44.41 IC3.11
BUTTON4_IN
  Top 0.254: SV1.10 29.05,46.4 30.8,46.4 33.2,44 41.3,44 41.63,44.34 IC3.12
CS_RF  (1 unrouted)
CS_SDCARD  (1 unrouted)
CSN  (1 unrouted)
DHT  (2 unrouted)
GND  (100 unrouted)
LED1_IN
  Top 0.254: SV1.3 31.01,38.2 39.8,38.2 40.37,37.63 IC3.4
LED2_IN
  Top 0.254: SV1.4 28.97,38.7 41.2,38.7 41.63,38.27 IC3.5
LED3_IN
  Top 0.254: SV1.5 42,40 42.91,39.09 IC3.6
LED4_IN
  Top 0.254: SV1.6 29.03,41.3 42.5,41.3 44.17,39.62 IC3.7
LIGHT  (2 unrouted)
LRXD  (2 unrouted)
LTXD  (2 unrouted)
MIC_P  (2 unrouted)
MIC_P_OUT  (2 unrouted)
MISO  (3 unrouted)
MOSI  (3 unrouted)
N$1
  Top 0.254: IC2.20 57.65,19.6 C4.1
N$2  (1 unrouted)
N$3
  Top 1.016: IC4.4 6.3,68.2 5,69.5 R8.2 R22.1
N$4  (6 unrouted)
  Top 1.016: PWR1.+6 13,6 D2.A
N$5  (2 unrouted)
N$6  (1 unrouted)
N$7  (1 unrouted)
N$8  (1 unrouted)
N$9  (2 unrouted)
N$11
  Top 0.254: LED6.C 38.95,55.9 R15.1
N$12
  Top 1.016: D6.C 11,69 9.7,67.7 IC4.2 15.17,58 L1.1
N$13  (1 unrouted)
N$14
  Top 0.254: R9.2 R12.2 40.4,54.65 40.4,60.3 41.05,60.95 T3.1
N$15  (2 unrouted)
N$16  (1 unrouted)
N$17  (1 unrouted)
N$24  (1 unrouted)
N$25  (1 unrouted)
N$29  (1 unrouted)
  Top 0.254: IC2.7 43,18 42.5,18.5 42.5,22.04 Q2.1
N$35  (1 unrouted)
  Top 0.254: Q2.2 42.26,17.2 IC2.8
NETLIGHT  (1 unrouted)
NETLIGHT_INFO  (2 unrouted)
PWRKEY  (4 unrouted)
PWRKEY_OUT  (3 unrouted)
RESET  (4 unrouted)
RF_ANT  (1 unrouted)
RXD  (2 unrouted)
SCK  (3 unrouted)
SCL  (4 unrouted)
SDA  (4 unrouted)
SIM_CLK  (1 unrouted)
SIM_DATA  (1 unrouted)
SIM_RST  (1 unrouted)
SIM_VDD  (2 unrouted)
SOFTRESET  (1 unrouted)
SPK_N  (5 unrouted)
SPK_P  (5 unrouted)
SRXD  (3 unrouted)
STATUS  (1 unrouted)
STATUS_INFO  (2 unrouted)
STXD  (3 unrouted)
TXD  (2 unrouted)
VCC  (via drill 0.6)
  Top 1.016: D2.C 17.4,6.4 C14.+ C10.+ C17.+ 17.35,21.95 C9.2 | C9.2 C11.2 C1.1 | C9.2 14,25.52 13.26,26.26 | 13.26,26.26 IC1.1 | 13.26,26.26 13.24,26.26 10.5,29 10.5,34.42 IC5.1 15.5,36.72 | C35.1 17.33,36.72 15.5,36.72 | IC4.1 11.4,65.1 14,62.5 19,62.5 20.5,61 20.5,55 17.5,52 17.5,48.1 C13.+ 17.4,47.9 v15.5,46 | v15.5,40 15.5,36.72
  Bottom 1.016: v15.5,46 v15.5,40
VDD_EXT  (4 unrouted)
WIFI_CHPD  (2 unrouted)
WIFI_RESET  (2 unrouted)

### Text on the board
tPlace: GSC v2.2 | ArteTechnic2015